# Altium schematic sheet [9]-Power.SchDoc
size A4
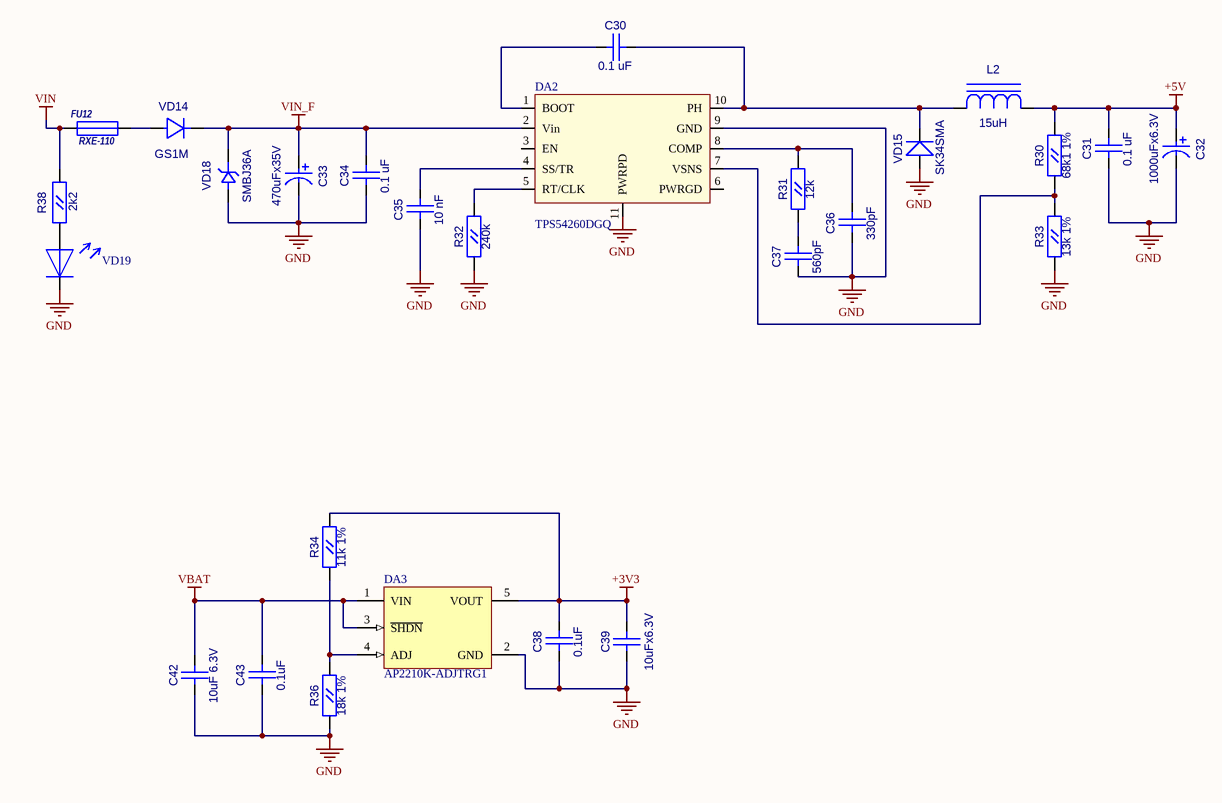
[diagram p0: [9]-Power.SchDoc]

## Parts
C30  0.1 uF  [CC0603]
C31  0.1 uF  [CC0603]
C32  1000uFx6.3V  [CC8X3.5]
C33  470uFx35V  [CC16X10_CAP0.5(1)(Primary)]
C34  0.1 uF  [CC0603]
C35  10 nF  [CC0603]
C36  330pF  [CC0603]
C37  560pF  [CC0603]
C38  0.1uF  [CC0603]
C39  10uFx6.3V  [CC0805]
C42  10uF 6.3V  [CC0805]
C43  0.1uF  [CC0603]
DA2  TPS54260DGQ  [S-PDSO-G10]
DA3  AP2210K-ADJTRG1  [SOT23-5]
FU12  RXE-110  [RXE-110]
L2  15uH  [SDR0805]
R30  68k1 1%  [RC0603]
R31  12k  [RC0603]
R32  240k  [RC0603]
R33  13k 1%  [RC0603]
R34  11k 1%  [RC0603]
R36  18k 1%  [RC0603]
R38  2k2  [RC0603]
VD14  GS1M  [SMA]
VD15  SK34SMA  [SMA]
VD18  SMBJ36A  [SMB]
VD19  LED_0805  [LED0805]  (value not drawn)

## Nets
+3V3: C38.1(A) C39.2(B) DA3.5(VOUT) R34.2(B)
+5V: C31.1(A) C32.1 L2.2(A) R30.2(B)
GND: C31.2(B) C32.2 C33.1 C34.2(B) C35.2(B) C36.2(B) C37.2(B) C38.2(B) C39.1(A) C42.1(A) C43.2(B) DA2.9(GND) DA2.11(PWRPD) DA3.2(GND) R32.1(A) R33.1(A) R36.1(A) VD15.1(A) VD18.1(A) VD19.2
VBAT: C42.2(B) C43.1(A) DA3.1(VIN) DA3.3(~{SHDN})
VIN: FU12.1 R38.2(B)
VIN_F: C33.2 C34.1(A) DA2.2(Vin) VD14.2(K) VD18.2(K)
NetC30_1: C30.1(A) DA2.10(PH) L2.1(C) VD15.2(K)
NetC30_2: C30.2(B) DA2.1(BOOT)
NetC35_1: C35.1(A) DA2.4(SS/TR)
NetC36_1: C36.1(A) DA2.8(COMP) R31.2(B)
NetC37_1: C37.1(A) R31.1(A)
NetDA2_5: DA2.5(RT/CLK) R32.2(B)
NetDA2_7: DA2.7(VSNS) R30.1(A) R33.2(B)
NetDA3_4: DA3.4(ADJ) R34.1(A) R36.2(B)
NetFU12_2: FU12.2 VD14.1(A)
NetR38_1: R38.1(A) VD19.1

Not connected (* = marked no-connect by the designer): DA2 3(EN) 6(PWRGD)

## Library data of the parts
C30 C31 C34-C38 C43 = CC0603
  C30 C31 C34: Value: 0.1 uF
  C35: Value: 10 nF
  C36: Value: 330pF
  C37: Value: 560pF
  C38 C43: Value: 0.1uF
C32 = CAP0.35: Value: 1000uFx6.3V
C33 = CAP0.5(1): Value: 470uFx35V
C39 C42 = CC0805
  C39: Value: 10uFx6.3V
  C42: Value: 10uF 6.3V
DA3 = MCP1824T-ADJE/OT: 300 mA, Low Voltage, Low Quiescent Current LDO Regulator, 5-Pin SOT-223, Extended Temperature, Tape and Reel; Published: 29-Jan-2009; DatasheetVersion: revA, Aug-2007; PackageVersion: revAW, Oct-2008; PackageReference: SOT-223-DC5; Publisher: Altium Limited; PackageDescription: 5-Lead Plastic Small Outline Transistor (DC) [SOT-223]; ComponentLink1Description: Manufacturer Link; ComponentLink1URL: http://www.microchip.com; ComponentLink2Description: Datasheet; ComponentLink2URL: http://ww1.microchip.com/downloads/en/DeviceDoc/22070a.pdf; ComponentLink3Description: Packaging Specification; ComponentLink3URL: http://ww1.microchip.com/downloads/en/PackagingSpec/00049AW.pdf
L2 = SDR0805: Value: 15uH
R30-R34 R36 R38 = RC0603
  R30: Value: 68k1 1%
  R31: Value: 12k
  R32: Value: 240k
  R33: Value: 13k 1%
  R34: Value: 11k 1%
  R36: Value: 18k 1%
  R38: Value: 2k2
VD14 = GS1M: Value: {Value}
VD15 = SK34SMA: Schottky Rectifier; Value: {Value}
VD18 = SMBJ: Value: SMBJ36A
FU12 = RXE-110: Value: *
VD19 = LED_0805: Value: LED_0805